# EasyEDA schematic Sheet_1.json
TITLE: Covid patient health monitoring; REV: 1.0; Date: 2022-11-29; Sheet: 1/1; Drawn By: Mohd Aman Ansari
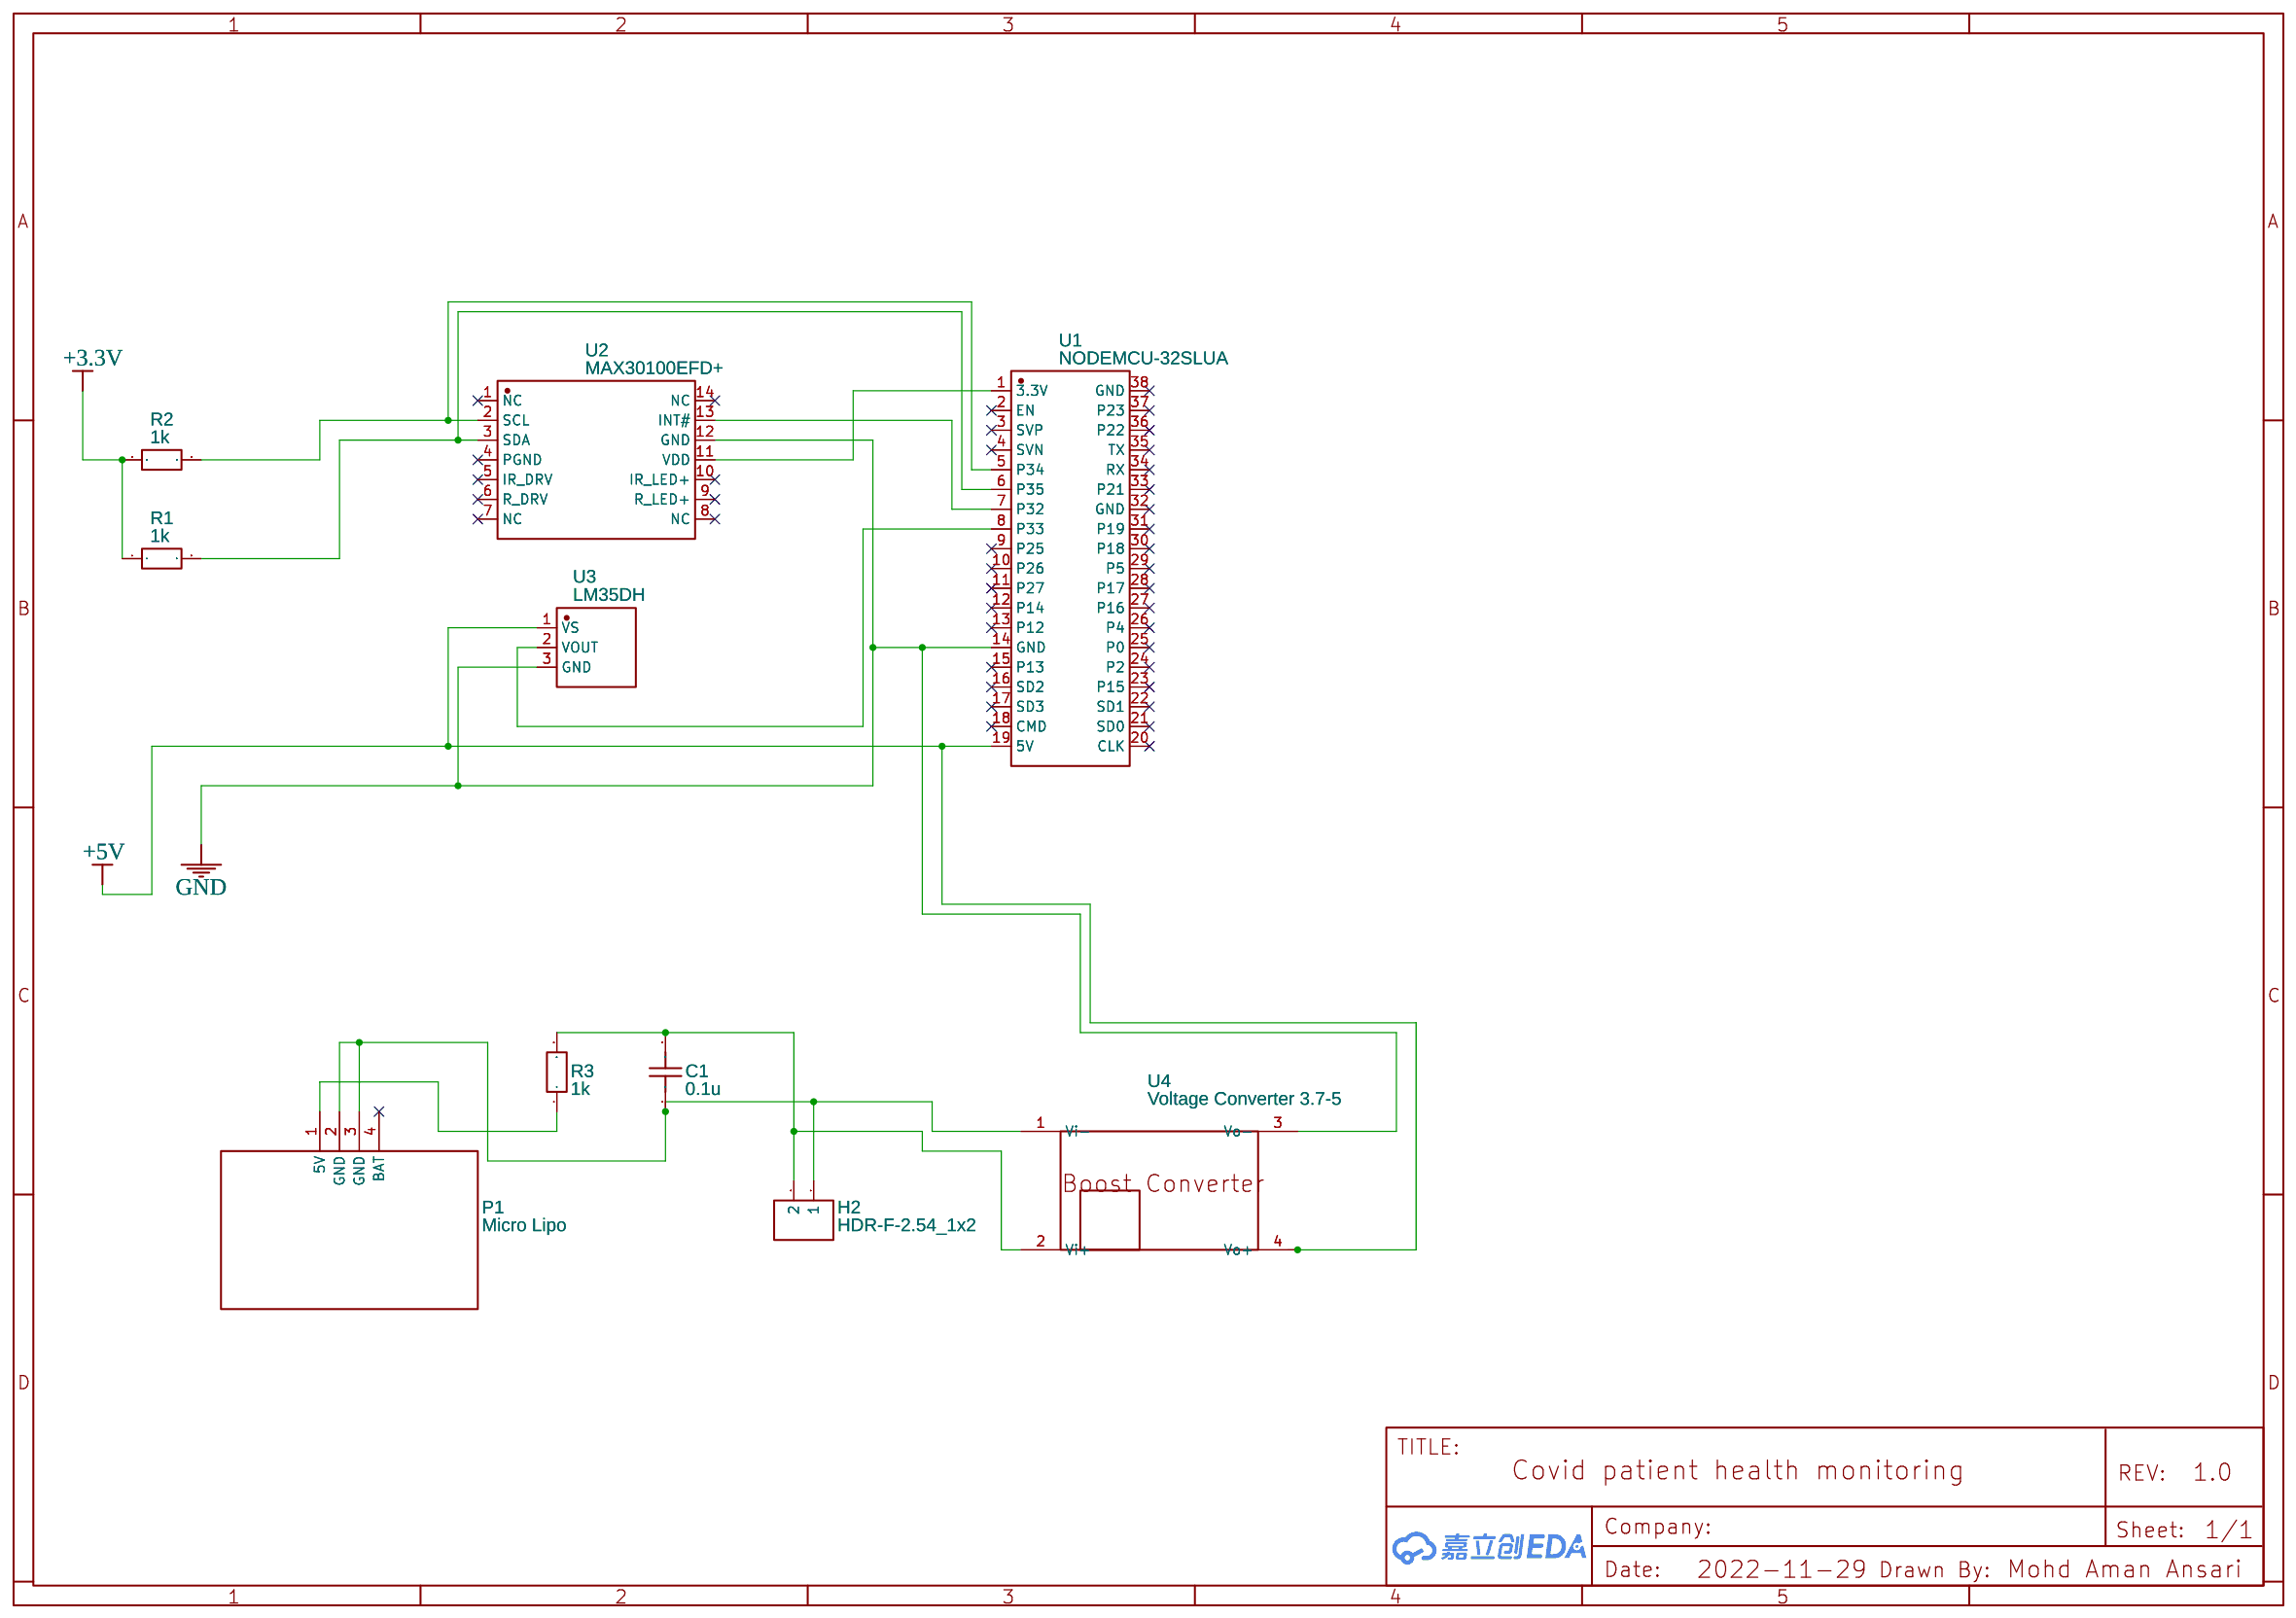
[diagram p0: schematic sheet]

## Parts
C1  0.1u  [C0603]
H2  HDR-F-2.54_1x2  [HDR-F-2.54_1X2]
P1  Micro Lipo  [MICRO LIPO]
R1  1k  [R0603]
R2  1k  [R0603]
R3  1k  [R0603]
U1  NODEMCU-32SLUA  [COMM-TH_NODEMCU-32SLUA]
U2  MAX30100EFD+  [SENSOR-SMD_MAX30100EFD]
U3  LM35DH  [TO-CAN-3_BD5.5-P1.27-L]
U4  Voltage Converter 3.7-5  [VOLTAGE CONVERTER 3.7-5 UTBAH]

## Library data of the parts
C1 = C_0603_US: Contributor: LCEDA_Lib
H2 = HDR-F-2.54_1x2: Supplier Part: C49661; Supplier: LCSC; Contributor: LCEDA_Lib
P1 = Micro Lipo: sourceId: 1T5FDZYC8
R1-R3 = R_0603_EU: Contributor: LCEDA_Lib
U1 = NODEMCU-32SLUA: Supplier: LCSC; Supplier Part: C111436; Manufacturer: Ai-Thinker(安信可); Manufacturer Part: NodeMCU-32SLua; link: https://atta.szlcsc.com/upload/public/pdf/source/20200715/C111436_7E615125D57381075B07FD61BFD5F595.pdf; JLCPCB Part Class: Extended Part; Contributor: lcsc
U2 = MAX30100EFD+: Supplier: LCSC; Manufacturer: MAXIM; Supplier Part: C92512; JLCPCB Part Class: Extended Part
U3 = LM35DH: Supplier: LCSC; Supplier Part: C2869869; Manufacturer: TI(德州仪器); Contributor: LCSC
U4 = Voltage Converter 3.7-5: Contributor: utbahR

## Nets
+3.3V: R1.1 R2.1
+5V: U1.19(5V) U3.1(VS) U4.4(Vo+)
GND: U1.14(GND) U2.12(GND) U3.3(GND) U4.3(Vo-)
Net-(C1-1): C1.1 H2.1 P1.2(GND) P1.3(GND) U4.1(Vi-)
Net-(C1-2): C1.2 H2.2 R3.2 U4.2(Vi+)
Net-(P1-1): P1.1(5V) R3.1
Net-(R1-2): R1.2 U1.6(P35) U2.3(SDA)
Net-(R2-2): R2.2 U1.5(P34) U2.2(SCL)
Net-(U1-1): U1.1(3.3V) U2.11(VDD)
Net-(U1-7): U1.7(P32) U2.13(INT#)
Net-(U1-8): U1.8(P33) U3.2(VOUT)

Not connected (* = marked no-connect by the designer): P1 4(BAT)*; U1 2(EN)* 3(SVP)* 4(SVN)* 9(P25)* 10(P26)* 11(P27)* 12(P14)* 13(P12)* 15(P13)* 16(SD2)* 17(SD3)* 18(CMD)* 20(CLK)* 21(SD0)* 22(SD1)* 23(P15)* 24(P2)* 25(P0)* 26(P4)* 27(P16)* 28(P17)* 29(P5)* 30(P18)* 31(P19)* 32(GND)* 33(P21)* 34(RX)* 35(TX)* 36(P22)* 37(P23)* 38(GND)*; U2 1(NC)* 4(PGND)* 5(IR_DRV)* 6(R_DRV)* 7(NC)* 8(NC)* 9(R_LED+)* 10(IR_LED+)* 14(NC)*
